# Altium schematic sheet keys.SchDoc
size A4; SheetNumber: 3; SheetTotal: 4
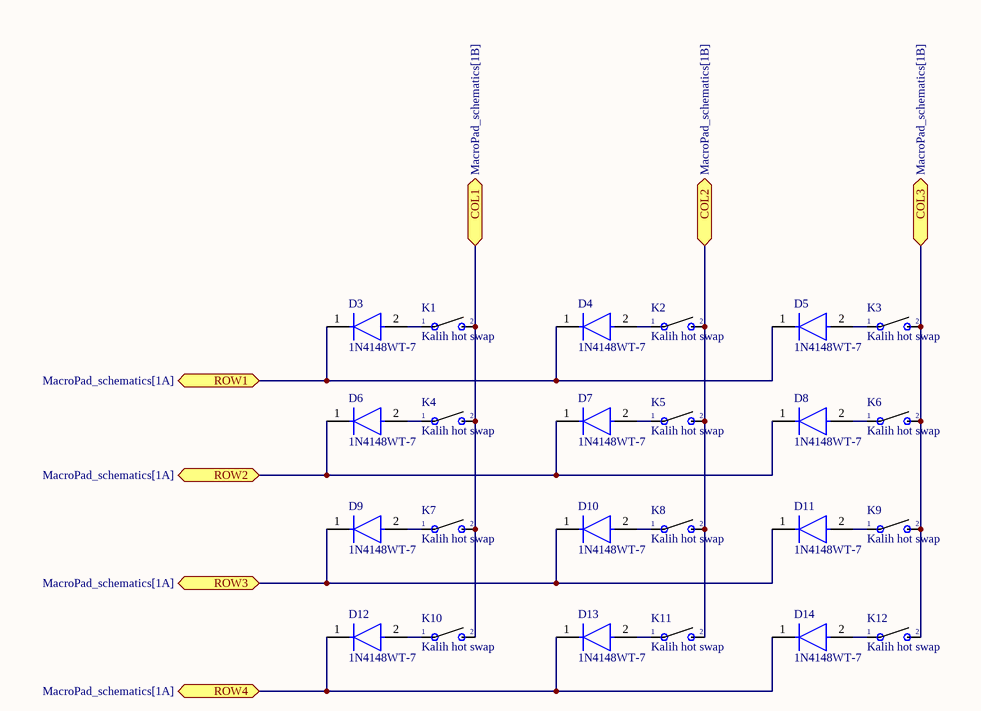
[diagram p0: keys.SchDoc]

## Parts
D3  1N4148WT-7  [FP-SOD523-MFG]
D4  1N4148WT-7  [FP-SOD523-MFG]
D5  1N4148WT-7  [FP-SOD523-MFG]
D6  1N4148WT-7  [FP-SOD523-MFG]
D7  1N4148WT-7  [FP-SOD523-MFG]
D8  1N4148WT-7  [FP-SOD523-MFG]
D9  1N4148WT-7  [FP-SOD523-MFG]
D10  1N4148WT-7  [FP-SOD523-MFG]
D11  1N4148WT-7  [FP-SOD523-MFG]
D12  1N4148WT-7  [FP-SOD523-MFG]
D13  1N4148WT-7  [FP-SOD523-MFG]
D14  1N4148WT-7  [FP-SOD523-MFG]
K1  Kalih hot swap  [Kailh_socket_MX_optional_reversible]
K2  Kalih hot swap  [Kailh_socket_MX_optional_reversible]
K3  Kalih hot swap  [Kailh_socket_MX_optional_reversible]
K4  Kalih hot swap  [Kailh_socket_MX_optional_reversible]
K5  Kalih hot swap  [Kailh_socket_MX_optional_reversible]
K6  Kalih hot swap  [Kailh_socket_MX_optional_reversible]
K7  Kalih hot swap  [Kailh_socket_MX_optional_reversible]
K8  Kalih hot swap  [Kailh_socket_MX_optional_reversible]
K9  Kalih hot swap  [Kailh_socket_MX_optional_reversible]
K10  Kalih hot swap  [Kailh_socket_MX_optional_reversible]
K11  Kalih hot swap  [Kailh_socket_MX_optional_reversible]
K12  Kalih hot swap  [Kailh_socket_MX_optional_reversible]

## Ports
COL1 (bidir, see MacroPad_schematics[1B]), COL2 (bidir, see MacroPad_schematics[1B]), COL3 (bidir, see MacroPad_schematics[1B]), ROW1 (bidir, see MacroPad_schematics[1A]), ROW2 (bidir, see MacroPad_schematics[1A]), ROW3 (bidir, see MacroPad_schematics[1A]), ROW4 (bidir, see MacroPad_schematics[1A])

## Nets
COL1: K1.2 K4.2 K7.2 K10.2 ; port COL1
COL2: K2.2 K5.2 K8.2 K11.2 ; port COL2
COL3: K3.2 K6.2 K9.2 K12.2 ; port COL3
ROW1: D3.1(C) D4.1(C) D5.1(C) ; port ROW1
ROW2: D6.1(C) D7.1(C) D8.1(C) ; port ROW2
ROW3: D9.1(C) D10.1(C) D11.1(C) ; port ROW3
ROW4: D12.1(C) D13.1(C) D14.1(C) ; port ROW4
NetD3_2: D3.2(A) K1.1
NetD4_2: D4.2(A) K2.1
NetD5_2: D5.2(A) K3.1
NetD6_2: D6.2(A) K4.1
NetD7_2: D7.2(A) K5.1
NetD8_2: D8.2(A) K6.1
NetD9_2: D9.2(A) K7.1
NetD10_2: D10.2(A) K8.1
NetD11_2: D11.2(A) K9.1
NetD12_2: D12.2(A) K10.1
NetD13_2: D13.2(A) K11.1
NetD14_2: D14.2(A) K12.1

## Library data of the parts
D3-D14 = CMP-2000-05518-3: DIODE GEN PURP 80V 125MA SOD523; Power Rating: 150mW; Peak Non-Repetitive Surge Current: 2A; Forward Voltage: 1.25V; Reverse Recovery Time: 4ns; Peak Reverse Current: 1uA; Max Repetitive Reverse Voltage (Vrrm): 100V; Capacitance: 2pF; Polarity: Standard; Element Configuration: Single; Forward Current: 250mA; Lead Free: Lead Free; Packaging: Tape and Reel; Length: 0.9mm; Min Operating Temperature: -65°C; Current Rating: 125mA; Max Reverse Voltage (DC): 80V; Width: 1.3mm; Package Quantity: 3000; Output Current: 125mA; Power Dissipation: 150mW; Max Operating Temperature: 150°C; Radiation Hardening: No; Average Rectified Current: 125mA; Height: 0.65mm; Voltage Rating (DC): 80V; Max Surge Current: 2A; Weight: 3.5E-05oz; Recovery Time: 4ns; Max Forward Surge Current (Ifsm): 2A; Contact Plating: Tin; Number of Pins: 2; Mount: Surface Mount; REACH SVHC: No SVHC
K1-K12 = Kalih hot swap: pin to pad: 1>3 2>4 6>4